# EAGLE design LPC_probe (EAGLE 7.2.0)
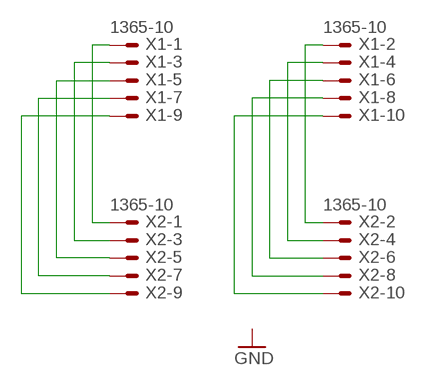
[diagram p0: schematic, sheet 1]

## Parts
X1  1365-10  [1365-10]
X2  1365-10  [1365-10]

## Nets
N$1: X1.1 X2.1
N$2: X1.3 X2.3
N$3: X1.5 X2.5
N$4: X1.7 X2.7
N$5: X1.9 X2.9
N$6: X1.2 X2.2
N$7: X1.4 X2.4
N$8: X1.6 X2.6
N$9: X1.8 X2.8
N$10: X1.10 X2.10

## Library data of the parts
X1 X2 = con-leotronics:1365-10: DUAL ROW STRAIGHT HEADER 1364 SERIES. 1.27mm x 1.27mm. Without Fixing Post. SMT Source: http://www.leotronics.co.uk/Conexcon/Data%20Sheets/sec.%20A/1364ing.pdf; OC_FARNELL: unknown; OC_NEWARK: unknown

## Board
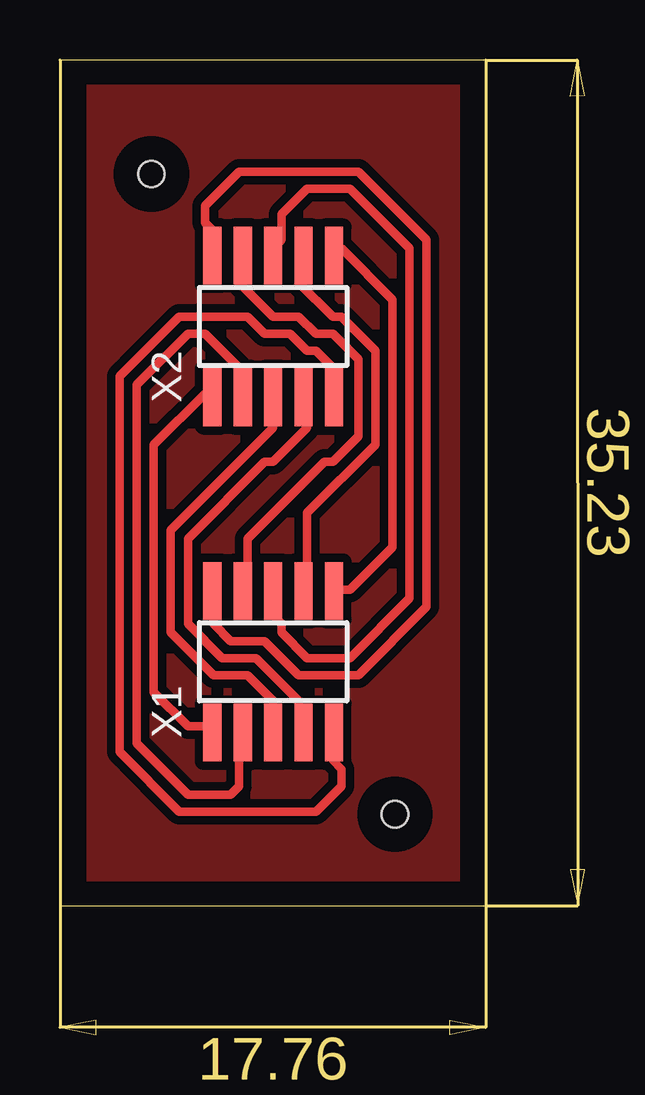
[diagram p1: board, top side]

Size 17.76 x 35.23 mm. Coordinates in mm from the lower left corner, seen from the top.
Outline: 0,0 17.76,0 17.76,35.23 0,35.23 0,0
Copper layers (1*16): Top 0.035mm / dielectric 1.5mm / Bottom 0.035mm
Design rules "thefablab": minimum track width 14mil, minimum drill 26mil, track to track 14mil, track to pad 14mil, pad to pad 14mil, via to via 14mil, smd to smd 14mil, copper to edge 40mil, drill to drill 8mil, minimum pad ring 10mil, minimum via ring 8mil, stop-mask expansion 4mil, vias tented up to drill 0mil, thermal gap 10mil
Holes 1.1 mm at 13.97,3.81 3.81,30.48

### Footprints (pad centres in the part's own frame; a part is rotated, then mirrored left to right if it is on the bottom)
1365-10 = smd 0.76 x 2.4: 1 -2.54,-2.95; 2 -2.54,2.95; 3 -1.27,-2.95; 4 -1.27,2.95; 5 0,-2.95; 6 0,2.95; 7 1.27,-2.95; 8 1.27,2.95; 9 2.54,-2.95; 10 2.54,2.95

### Placement (x,y rotation side)
X1  8.89,10.16 0 top
X2  8.89,24.13 0 top

### Tracks (layer width: path | path; a pad name or v marks a point on that pad's centre or on a via)
GND
  pour Top: 0,35.56 17.78,35.56 17.78,0 0,0
N$1
  Top 0.356: X1.1 6.04,7.47 5.33,7.47 3.91,8.89 3.91,19.2 6.04,21.34 X2.1
N$2
  Top 0.356: X1.3 7.47,7.11 7.47,4.98 7.11,4.62 5.33,4.62 3.2,6.76 3.2,21.69 5.33,23.82 6.04,23.82 7.47,22.4 7.47,21.34 X2.3
N$3
  Top 0.356: X1.5 8.89,8.53 7.82,9.6 6.4,9.6 4.62,11.38 4.62,15.65 8.89,19.91 X2.5
N$4
  Top 0.356: X1.7 9.96,7.47 9.96,8.53 8.18,10.31 6.76,10.31 5.33,11.73 5.33,15.29 8.53,18.49 8.89,18.49 10.31,19.91 10.31,20.98 X2.7
N$5
  Top 0.356: X1.9 11.38,7.11 11.38,6.04 11.73,5.69 11.73,4.98 10.67,3.91 4.98,3.91 2.49,6.4 2.49,22.05 4.98,24.54 7.82,24.54 8.53,23.82 9.6,23.82 10.31,23.11 10.67,23.11 11.38,22.4 11.38,21.34 X2.9
N$6
  Top 0.356: X1.2 6.4,12.8 6.4,11.73 7.11,11.02 8.53,11.02 9.96,9.6 12.45,9.6 15.29,12.45 15.29,27.74 12.45,30.58 7.47,30.58 6.04,29.16 6.04,28.45 6.4,28.09 6.4,27.38 X2.2
N$7
  Top 0.356: X1.4 7.82,13.16 7.82,15.29 11.02,18.49 11.38,18.49 12.45,19.56 12.45,22.76 11.38,23.82 10.67,23.82 9.96,24.54 8.89,24.54 7.47,25.96 7.47,27.03 X2.4
N$8
  Top 0.356: X1.6 8.89,12.09 9.25,11.73 9.25,11.38 10.31,10.31 12.09,10.31 14.58,12.8 14.58,27.38 12.09,29.87 10.31,29.87 9.25,28.8 9.25,27.74 8.89,27.38 X2.6
N$9
  Top 0.356: X1.8 10.31,13.16 10.31,16.36 13.16,19.2 13.16,23.11 11.73,24.54 11.38,24.54 9.96,25.96 9.96,27.03 X2.8
N$10
  Top 0.356: X1.10 11.73,13.16 12.09,13.16 13.87,14.94 13.87,25.25 11.73,27.38 X2.10